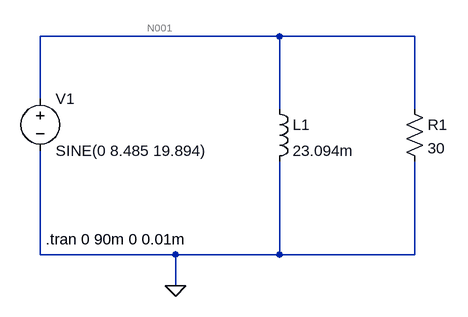
[diagram p0: schematic Lab3_1_8.asc]
Lab3_1_8.asc, the LTspice schematic file:
Version 4
SHEET 1 880 680
WIRE 448 16 80 16
WIRE 656 16 448 16
WIRE 80 112 80 16
WIRE 448 128 448 16
WIRE 656 128 656 16
WIRE 80 352 80 192
WIRE 288 352 80 352
WIRE 448 352 448 208
WIRE 448 352 288 352
WIRE 656 352 656 208
WIRE 656 352 448 352
WIRE 288 400 288 352
FLAG 288 400 0
SYMBOL voltage 80 96 R0
WINDOW 123 0 0 Left 0
WINDOW 39 0 0 Left 0
SYMATTR InstName V1
SYMATTR Value SINE(0 8.485 19.894)
SYMBOL res 640 112 R0
SYMATTR InstName R1
SYMATTR Value 30
SYMBOL ind 432 112 R0
SYMATTR InstName L1
SYMATTR Value 23.094m
SYMATTR SpiceLine Rser=5
TEXT 88 328 Left 2 !.tran 0 90m 0 0.01m

The netlist it stands for:
* Lab3_1_8.asc
V1 N001 0 SINE(0 8.485 19.894)
R1 N001 0 30
L1 N001 0 23.094m Rser=5
.tran 0 90m 0 0.01m
.backanno
.end

* Results of the author's LTspice run, read from the files saved beside the schematic
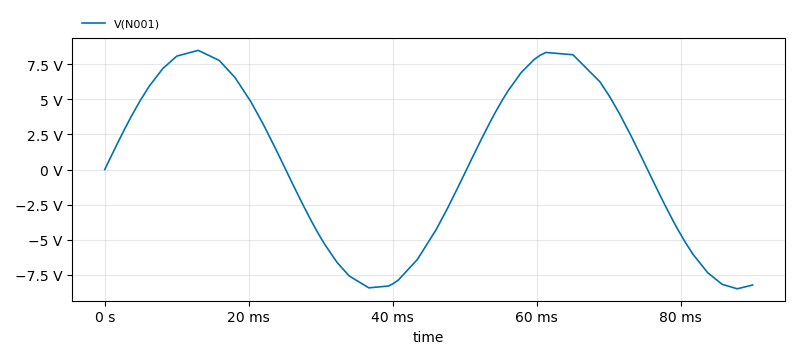
[diagram p1: Transient Analysis of Lab3_1_8.asc, plotted from the saved traces]
* Transient Analysis, 1 run:
*   V(N001): min -8.484 V, max 8.472 V, average 553.8 mV, rms 6.034 V, last -8.212 V